# Altium schematic sheet Regulator_Mechanical.SchDoc: LPEDT_Assignment
size A; DocumentNumber: 1; Revision: 1; SheetNumber: 2; SheetTotal: 2
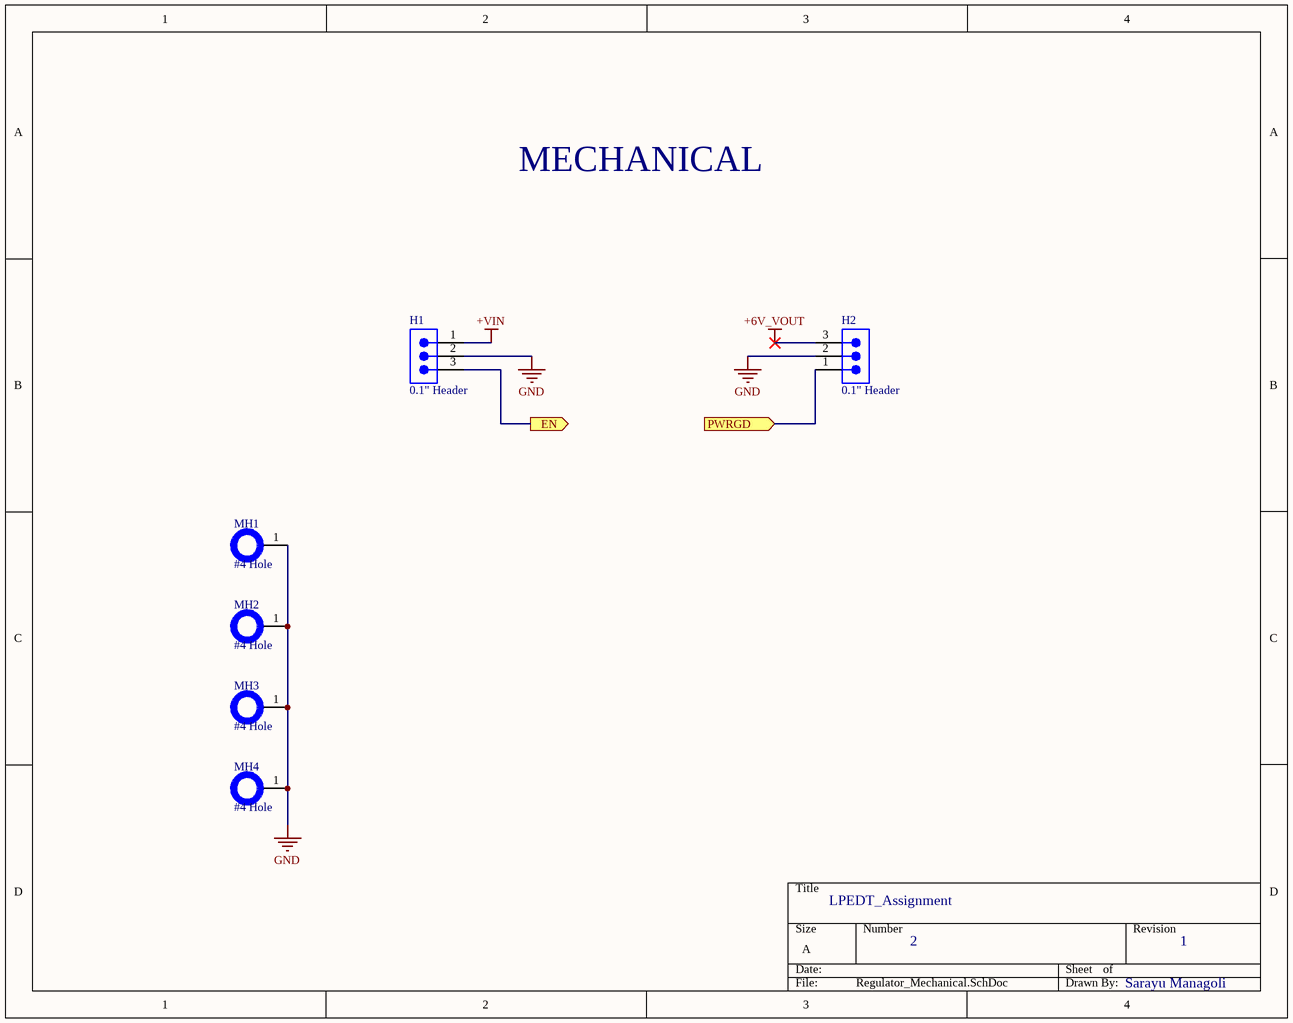
[diagram p0: Regulator_Mechanical.SchDoc]

## Parts
H1  0.1" Header  [3-PIN_MALE_HEADER_01-IN]
H2  0.1" Header  [3-PIN_MALE_HEADER_01-IN]
MH1  #4 Hole  [HOLE_#4]  (no BOM)
MH2  #4 Hole  [HOLE_#4]  (no BOM)
MH3  #4 Hole  [HOLE_#4]  (no BOM)
MH4  #4 Hole  [HOLE_#4]  (no BOM)

## Ports
EN (out), PWRGD (in)

## Nets
+6V_VOUT: H2.3
+VIN: H1.1
GND: H1.2 H2.2 MH1.1 MH2.1 MH3.1 MH4.1
EN: H1.3 ; port EN
PWRGD: H2.1 ; port PWRGD

## Notes on the sheet
- MECHANICAL
- Sarayu Managoli

## Library data of the parts
H1 H2 = PRPC003SAAN-RC: CONN HEADER VERT 3POS 2.54MM; Manufacturer: Sullins; Connector Type: Header, Unshrouded, Breakaway; Number of Positions: 3; Number of Positions Loaded: All; Pitch: 0.100" (2.54mm); Online Catalog: 0.100" (2.54mm) Pitch Connector Headers; Other Names: S9510E-03  S9510E-03-ND; Supplier 1: Digi-Key; Manufacturer Part Number: PRPC003SAAN-RC; Stock 1: 19067; Pricing 1: 1=0.12, 10=0.109, 25=0.0812, 50=0.0696, 100=0.0673, 250=0.058, 500=0.0557 (USD); Standard Package: 1; Category: Connectors, Interconnects; Family: Rectangular Connectors - Headers, Male Pins; Series: -; Packaging: Bulk; Contact Type: Male Pin; Number of Rows: 1; Row Spacing: -; Contact Mating Length: 0.230" (5.84mm); Mounting Type: Through Hole; Termination: Solder; Fastening Type: -; Features: -; Contact Finish: Gold; Contact Finish Thickness: Flash; Color: Black; ComponentLink1URL: https://media.digikey.com/PDF/Data%20Sheets/Sullins%20PDFs/xRxCzzzSxxN-RC_ST_11635-B.pdf?src-supplier=Digi-Key; ComponentLink1Description: https://media.digikey.com/PDF/Data%20Sheets/Sullins%20PDFs/xRxCzzzSxxN-RC_ST_11635-B.pdf?src-supplier=Digi-Key; Supplier Part Number 1: S1011EC-03-ND
MH1-MH4 = HOLE_#4